# Altium schematic sheet JR_expansion.SchDoc
size A4
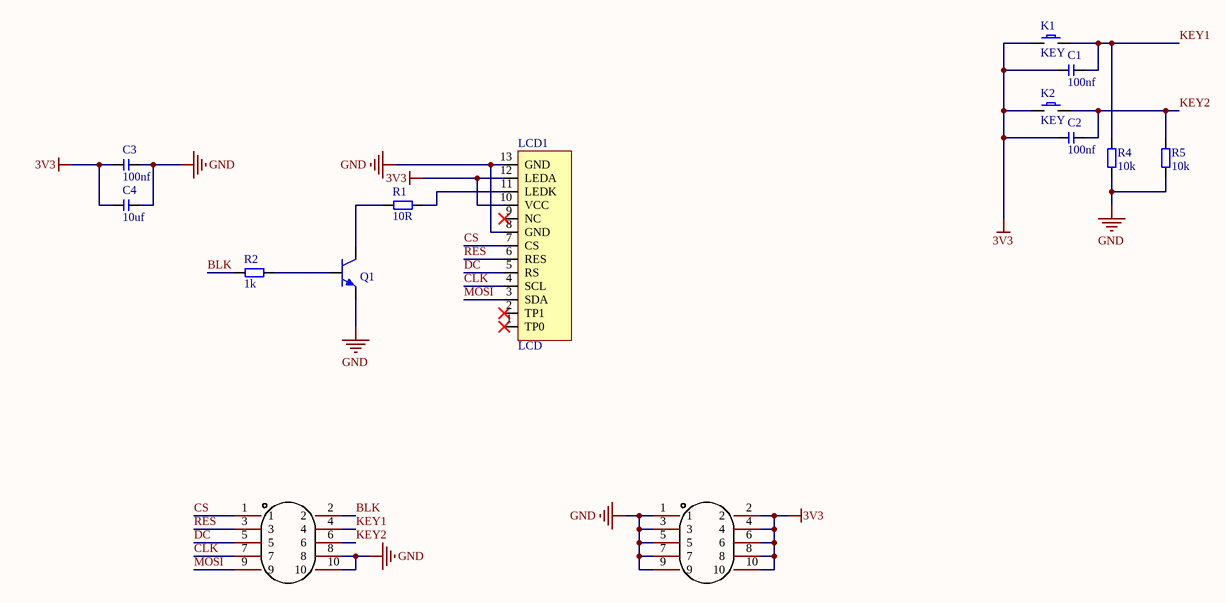
[diagram p0: JR_expansion.SchDoc]

## Parts
C1  100nf  [C0603]
C2  100nf  [C0603]
C3  100nf  [C0603]
C4  10uf  [C0603]
K1  KEY  [Key]
K2  KEY  [Key]
LCD1  LCD  [lcd 0.96‘]
Q1  BJT_NPN  [SOT23]  (value not drawn)
R1  10R  [R0603]
R2  1k  [R0603]
R4  10k  [R0603]
R5  10k  [R0603]
U1  2343U-205CNG1SNT01  [CONN-SMD_10P-P1.27_XFCN_PZ127VS-12-10-H10-A38]  (value not drawn)
U2  2343U-205CNG1SNT01  [CONN-SMD_10P-P1.27_XFCN_PZ127VS-12-10-H10-A38]  (value not drawn)

## Nets
3V3: C1.1 C2.1 C3.1 C4.1 K1.1 K2.1 LCD1.10(VCC) LCD1.12(LEDA) U2.2 U2.4 U2.6 U2.8 U2.10
GND: C3.2 C4.2 LCD1.8(GND) LCD1.13(GND) Q1.2(E) R4.1 R5.1 U1.8 U1.10 U2.1 U2.3 U2.5 U2.7 U2.9
BLK: R2.1 U1.2
CLK: LCD1.4(SCL) U1.7
CS: LCD1.7(CS) U1.1
DC: LCD1.5(RS) U1.5
KEY1: C1.2 K1.2 R4.2 U1.4
KEY2: C2.2 K2.2 R5.2 U1.6
MOSI: LCD1.3(SDA) U1.9
RES: LCD1.6(RES) U1.3
NetLCD1_11: LCD1.11(LEDK) R1.2
NetQ1_1: Q1.1(B) R2.2
NetQ1_3: Q1.3(C) R1.1

Not connected (* = marked no-connect by the designer): LCD1 1(TP0)* 2(TP1)* 9(NC)*

## Library data of the parts
C1-C4 = CAP: 无极电容; accuracy: 20%
  C1-C3: value: 100nf
  C4: value: 10uf
Q1 = BJT_NPN: Transistor
R1 R2 R4 R5 = RES: 电阻
  R1: Value: 10R
  R2: Value: 1k
  R4 R5: Value: 10k
U1 U2 = 1.27排针 2*5P: Manufacturer: 华宇创; Add into BOM: yes; Pitch: 1.27mm; Number of Holes: 10; Holes Structure: 2x5P; Name: 2343U-205CNG1SNT01; Symbol: 2343U-205CNG1SNT01; Device: 2343U-205CNG1SNT01; LCSC Part Name: 1.27mm 2x5P U型/环保耐高温/镀金; Supplier Part: C350287; Manufacturer Part: 2343U-205CNG1SNT01; Supplier Footprint: 插件,P=1.27mm; JLCPCB Part Class: Extended Part; Datasheet: https://atta.szlcsc.com/upload/public/pdf/source/20181220/C350287_D742F1AEC20B5CCE37A83D869655120C.pdf; Supplier: LCSC; Convert to PCB: yes; Number of Rows: 2; Row Spacing: 1.27mm; Mounting Type: 直插; Insulation Height: -; Contact Material: 磷青铜; Contact Plating: -